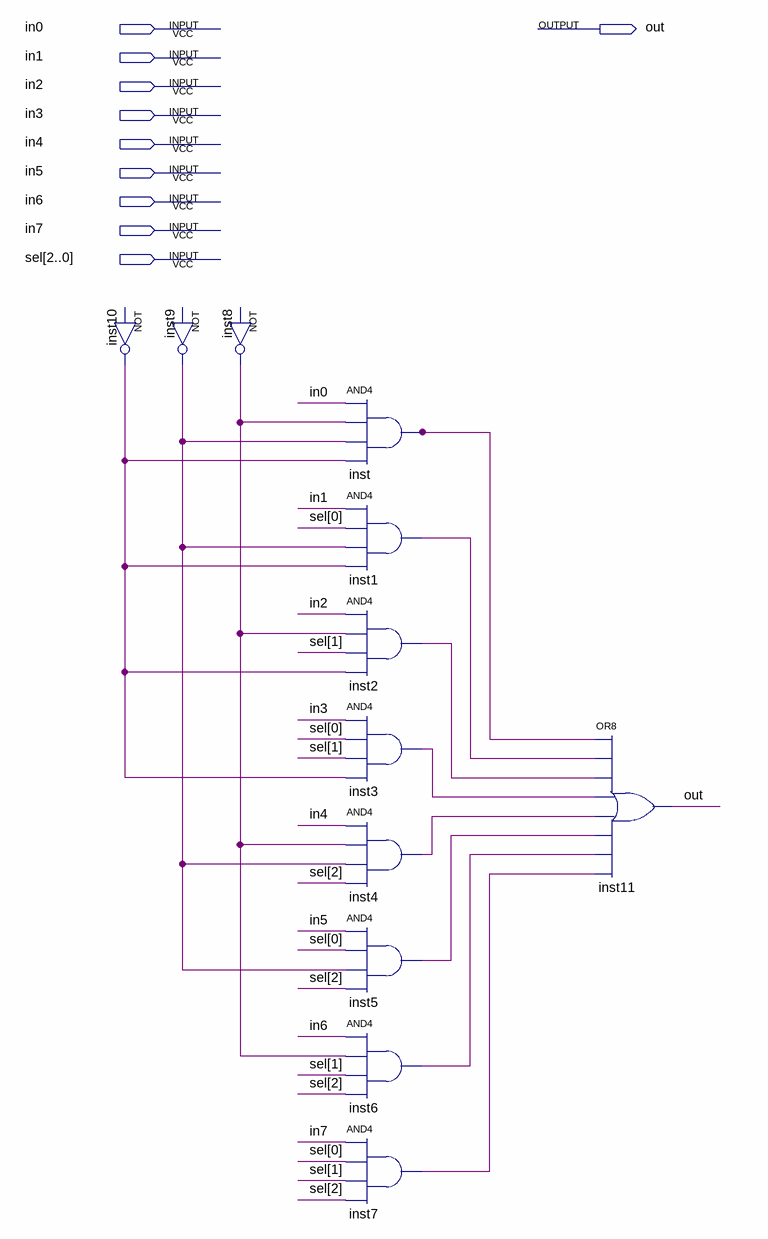
[diagram p0: schematic sheet]
// Quartus schematic MUX_8x3_1b.bdf as structural Verilog: 12 symbols, 10 pins
module MUX_8x3_1b (
  input  in0,
  input  in1,
  input  in2,
  input  in3,
  input  in4,
  input  in5,
  input  in6,
  input  in7,
  input  [2:0] sel,
  output out
);

  wire inst1_out, inst2_out, inst3_out, inst4_out, inst5_out, inst6_out, inst7_out, inst8_out, inst9_out,
       inst10_out, inst_out;

  // NOT inst10 has open pins: IN=open, OUT=inst10_out
  // NOT inst9 has open pins: IN=open, OUT=inst9_out
  // NOT inst8 has open pins: IN=open, OUT=inst8_out
  and inst (inst_out, in0, inst8_out, inst9_out, inst10_out);
  and inst1 (inst1_out, in1, sel[0], inst9_out, inst10_out);
  and inst2 (inst2_out, in2, inst8_out, sel[1], inst10_out);
  and inst3 (inst3_out, in3, sel[0], sel[1], inst10_out);
  and inst4 (inst4_out, in4, inst8_out, inst9_out, sel[2]);
  and inst5 (inst5_out, in5, sel[0], inst9_out, sel[2]);
  and inst6 (inst6_out, in6, inst8_out, sel[1], sel[2]);
  and inst7 (inst7_out, in7, sel[0], sel[1], sel[2]);
  or inst11 (out, inst_out, inst1_out, inst2_out, inst3_out, inst4_out, inst5_out, inst6_out, inst7_out);
endmodule
